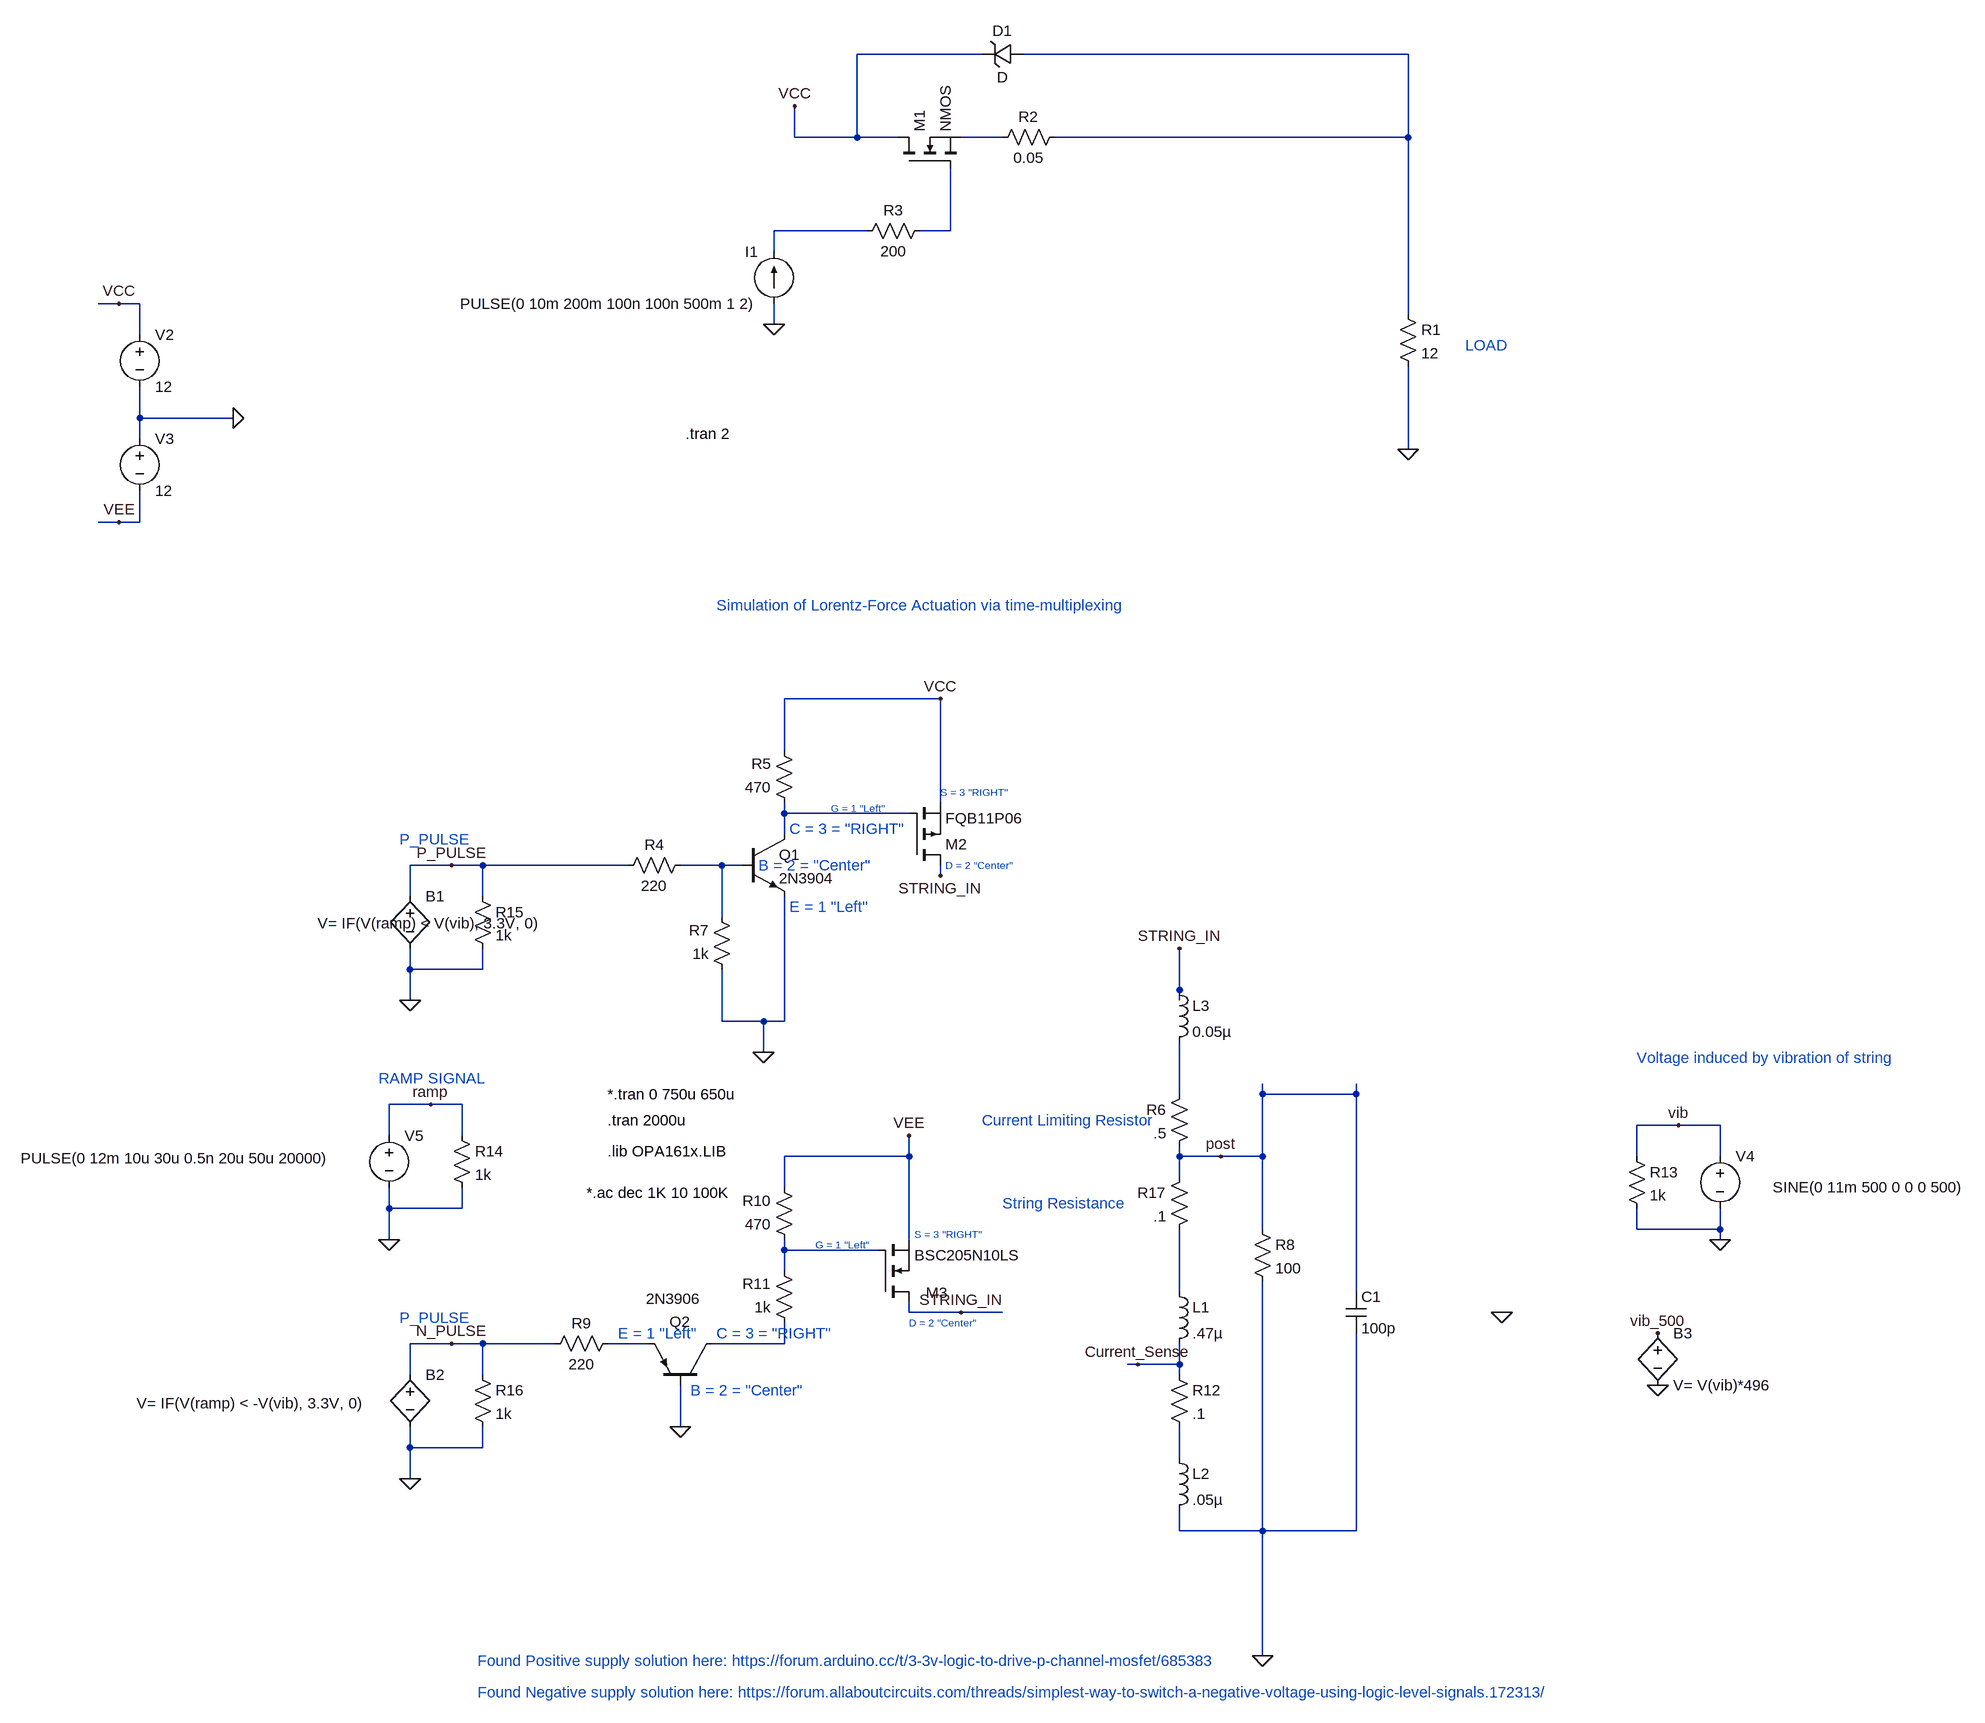
[diagram p0: schematic Draft4.asc]
Draft4.asc, the LTspice schematic file:
Version 4
SHEET 1 1880 2648
WIRE 352 112 160 112
WIRE 1008 112 416 112
WIRE 64 240 64 192
WIRE 160 240 160 112
WIRE 160 240 64 240
WIRE 224 240 160 240
WIRE 384 240 320 240
WIRE 1008 240 1008 112
WIRE 1008 240 464 240
WIRE 176 384 32 384
WIRE 304 384 304 288
WIRE 304 384 256 384
WIRE 32 416 32 384
WIRE -976 496 -1008 496
WIRE -944 496 -976 496
WIRE 1008 512 1008 240
WIRE 32 528 32 496
WIRE -944 544 -944 496
WIRE -944 672 -944 624
WIRE -800 672 -944 672
WIRE -944 704 -944 672
WIRE 1008 720 1008 592
WIRE -976 832 -1008 832
WIRE -944 832 -944 784
WIRE -944 832 -976 832
WIRE 288 1104 48 1104
WIRE 48 1184 48 1104
WIRE 288 1264 288 1104
WIRE 48 1280 48 1264
WIRE 240 1280 48 1280
WIRE 48 1312 48 1280
WIRE -464 1360 -528 1360
WIRE -416 1360 -464 1360
WIRE -192 1360 -416 1360
WIRE -48 1360 -112 1360
WIRE -16 1360 -48 1360
WIRE 288 1376 288 1360
WIRE -528 1408 -528 1360
WIRE -416 1408 -416 1360
WIRE -48 1440 -48 1360
WIRE -528 1520 -528 1488
WIRE -416 1520 -416 1488
WIRE -416 1520 -528 1520
WIRE 656 1552 656 1488
WIRE -528 1568 -528 1520
WIRE 656 1568 656 1552
WIRE -48 1600 -48 1520
WIRE 16 1600 -48 1600
WIRE 48 1600 48 1408
WIRE 48 1600 16 1600
WIRE 16 1648 16 1600
WIRE 656 1712 656 1632
WIRE 784 1712 784 1696
WIRE 928 1712 928 1696
WIRE 928 1712 784 1712
WIRE -496 1728 -560 1728
WIRE -448 1728 -496 1728
WIRE 1424 1760 1360 1760
WIRE 1488 1760 1424 1760
WIRE -560 1776 -560 1728
WIRE -448 1776 -448 1728
WIRE 240 1808 240 1776
WIRE 240 1808 48 1808
WIRE 656 1808 656 1792
WIRE 720 1808 656 1808
WIRE 784 1808 784 1712
WIRE 784 1808 720 1808
WIRE 1360 1808 1360 1760
WIRE 1488 1808 1488 1760
WIRE 656 1840 656 1808
WIRE 48 1856 48 1808
WIRE -560 1888 -560 1856
WIRE -448 1888 -448 1856
WIRE -448 1888 -560 1888
WIRE 784 1920 784 1808
WIRE 1360 1920 1360 1888
WIRE 1488 1920 1488 1888
WIRE 1488 1920 1360 1920
WIRE -560 1936 -560 1888
WIRE 240 1936 240 1808
WIRE 1488 1936 1488 1920
WIRE 48 1952 48 1936
WIRE 192 1952 48 1952
WIRE 48 1984 48 1952
WIRE 656 2016 656 1920
WIRE 928 2016 928 1712
WIRE 240 2048 240 2032
WIRE 320 2048 240 2048
WIRE 384 2048 320 2048
WIRE -464 2096 -528 2096
WIRE -416 2096 -464 2096
WIRE -304 2096 -416 2096
WIRE -160 2096 -224 2096
WIRE 48 2096 48 2064
WIRE 48 2096 -64 2096
WIRE 592 2128 576 2128
WIRE 656 2128 656 2096
WIRE 656 2128 592 2128
WIRE -528 2144 -528 2096
WIRE -416 2144 -416 2096
WIRE 656 2144 656 2128
WIRE -112 2224 -112 2160
WIRE -528 2256 -528 2224
WIRE -416 2256 -416 2224
WIRE -416 2256 -528 2256
WIRE 656 2272 656 2224
WIRE -528 2304 -528 2256
WIRE 656 2384 656 2352
WIRE 784 2384 784 2000
WIRE 784 2384 656 2384
WIRE 928 2384 928 2080
WIRE 928 2384 784 2384
WIRE 784 2576 784 2384
FLAG 64 192 VCC
FLAG 1008 720 0
FLAG 32 528 0
FLAG -976 832 VEE
FLAG -800 672 0
FLAG -976 496 VCC
FLAG 16 1648 0
FLAG 288 1104 VCC
FLAG 784 2576 0
FLAG 656 1488 STRING_IN
FLAG 288 1376 STRING_IN
FLAG 240 1776 VEE
FLAG 320 2048 STRING_IN
FLAG -112 2224 0
FLAG 1152 2048 0
FLAG 592 2128 Current_Sense
FLAG 1488 1936 0
FLAG 1424 1760 vib
FLAG -560 1936 0
FLAG -496 1728 ramp
FLAG -528 1568 0
FLAG -464 1360 P_PULSE
FLAG -528 2304 0
FLAG -464 2096 N_PULSE
FLAG 720 1808 post
FLAG 1392 2160 0
FLAG 1392 2080 vib_500
SYMBOL nmos 224 288 R270
SYMATTR InstName M1
SYMBOL TVSdiode 416 96 R90
WINDOW 0 -4 32 VBottom 2
WINDOW 3 36 32 VTop 2
SYMATTR InstName D1
SYMBOL res 992 496 R0
SYMATTR InstName R1
SYMATTR Value 12
SYMBOL res 480 224 R90
WINDOW 0 0 56 VBottom 2
WINDOW 3 32 56 VTop 2
SYMATTR InstName R2
SYMATTR Value 0.05
SYMBOL current 32 496 R180
WINDOW 0 24 80 Left 2
WINDOW 3 24 0 Left 2
SYMATTR InstName I1
SYMATTR Value PULSE(0 10m 200m 100n 100n 500m 1 2)
SYMBOL res 272 368 R90
WINDOW 0 0 56 VBottom 2
WINDOW 3 32 56 VTop 2
SYMATTR InstName R3
SYMATTR Value 200
SYMBOL voltage -944 528 R0
SYMATTR InstName V2
SYMATTR Value 12
SYMBOL pmos 240 1360 M180
SYMATTR InstName M2
SYMATTR Value FQB11P06
SYMBOL npn -16 1312 R0
SYMATTR InstName Q1
SYMATTR Value 2N3904
SYMBOL res -96 1344 R90
WINDOW 0 0 56 VBottom 2
WINDOW 3 32 56 VTop 2
SYMATTR InstName R4
SYMATTR Value 220
SYMBOL res 64 1280 R180
WINDOW 0 36 76 Left 2
WINDOW 3 36 40 Left 2
SYMATTR InstName R5
SYMATTR Value 470
SYMBOL res 672 1696 M0
SYMATTR InstName R6
SYMATTR Value .5
SYMBOL voltage -944 688 R0
SYMATTR InstName V3
SYMATTR Value 12
SYMBOL ind 640 2000 R0
SYMATTR InstName L1
SYMATTR Value .47µ
SYMBOL res -32 1536 R180
WINDOW 0 36 76 Left 2
WINDOW 3 36 40 Left 2
SYMATTR InstName R7
SYMATTR Value 1k
SYMBOL res 768 1904 R0
SYMATTR InstName R8
SYMATTR Value 100
SYMBOL res -208 2080 R90
WINDOW 0 0 56 VBottom 2
WINDOW 3 32 56 VTop 2
SYMATTR InstName R9
SYMATTR Value 220
SYMBOL res 64 1952 R180
WINDOW 0 36 76 Left 2
WINDOW 3 36 40 Left 2
SYMATTR InstName R10
SYMATTR Value 470
SYMBOL res 64 2080 R180
WINDOW 0 36 76 Left 2
WINDOW 3 36 40 Left 2
SYMATTR InstName R11
SYMATTR Value 1k
SYMBOL nmos 192 2032 M180
WINDOW 0 74 14 Left 2
SYMATTR InstName M3
SYMATTR Value BSC205N10LS
SYMBOL pnp -64 2160 M270
WINDOW 0 98 65 VLeft 2
WINDOW 3 133 101 VLeft 2
SYMATTR InstName Q2
SYMATTR Value 2N3906
SYMBOL res 640 2128 R0
SYMATTR InstName R12
SYMATTR Value .1
SYMBOL cap 912 2016 R0
SYMATTR InstName C1
SYMATTR Value 100p
SYMBOL ind 640 2256 R0
SYMATTR InstName L2
SYMATTR Value .05µ
SYMBOL voltage 1488 1792 R0
WINDOW 3 81 63 Left 2
SYMATTR Value SINE(0 11m 500 0 0 0 500)
SYMATTR InstName V4
SYMATTR Value2 AC 1
SYMBOL res 1344 1792 R0
SYMATTR InstName R13
SYMATTR Value 1k
SYMBOL voltage -560 1760 R0
WINDOW 3 -567 51 Left 2
SYMATTR Value PULSE(0 12m 10u 30u 0.5n 20u 50u 20000)
SYMATTR InstName V5
SYMBOL bv -528 1392 R0
WINDOW 3 -142 57 Left 2
SYMATTR Value V= IF(V(ramp) < V(vib), 3.3V, 0)
SYMATTR InstName B1
SYMBOL res -464 1760 R0
SYMATTR InstName R14
SYMATTR Value 1k
SYMBOL res -432 1392 R0
SYMATTR InstName R15
SYMATTR Value 1k
SYMBOL bv -528 2128 R0
WINDOW 3 -421 60 Left 2
SYMATTR Value V= IF(V(ramp) < -V(vib), 3.3V, 0)
SYMATTR InstName B2
SYMBOL res -432 2128 R0
SYMATTR InstName R16
SYMATTR Value 1k
SYMBOL res 672 1824 M0
SYMATTR InstName R17
SYMATTR Value .1
SYMBOL ind 640 1536 R0
SYMATTR InstName L3
SYMATTR Value 0.05µ
SYMBOL bv 1392 2064 R0
SYMATTR InstName B3
SYMATTR Value V= V(vib)*496
TEXT 1096 560 Left 2 ;LOAD
TEXT -104 696 Left 2 !.tran 2
TEXT -224 1712 Left 2 !*.tran 0 750u 650u
TEXT -208 2080 Left 2 ;E = 1 "Left"
TEXT -96 2168 Left 2 ;B = 2 = "Center"
TEXT -56 2080 Left 2 ;C = 3 = "RIGHT"
TEXT 56 1424 Left 2 ;E = 1 "Left"
TEXT 8 1360 Left 2 ;B = 2 = "Center"
TEXT 56 1304 Left 2 ;C = 3 = "RIGHT"
TEXT 96 1944 Left 1 ;G = 1 "Left"
TEXT 240 2064 Left 1 ;D = 2 "Center"
TEXT 248 1928 Left 1 ;S = 3 "RIGHT"
TEXT 120 1272 Left 1 ;G = 1 "Left"
TEXT 288 1248 Left 1 ;S = 3 "RIGHT"
TEXT 296 1360 Left 1 ;D = 2 "Center"
TEXT -56 960 Left 2 ;Simulation of Lorentz-Force Actuation via time-multiplexing
TEXT -424 2632 Left 2 ;Found Negative supply solution here: https://forum.allaboutcircuits.com/threads/simplest-way-to-switch-a-negative-voltage-using-logic-level-signals.172313/
TEXT -424 2584 Left 2 ;Found Positive supply solution here: https://forum.arduino.cc/t/3-3v-logic-to-drive-p-channel-mosfet/685383
TEXT -576 1688 Left 2 ;RAMP SIGNAL
TEXT -544 1320 Left 2 ;P_PULSE
TEXT -544 2056 Left 2 ;P_PULSE
TEXT 1360 1656 Left 2 ;Voltage induced by vibration of string
TEXT -224 1752 Left 2 !.tran 2000u
TEXT -224 1800 Left 2 !.lib OPA161x.LIB
TEXT 352 1752 Left 2 ;Current Limiting Resistor
TEXT 384 1880 Left 2 ;String Resistance
TEXT -256 1864 Left 2 !*.ac dec 1K 10 100K

The netlist it stands for:
* Draft4.asc
M1 VCC N004 N002 N002 NMOS
D1 N001 VCC D
R1 N001 0 12
R2 N001 N002 0.05
I1 0 N003 PULSE(0 10m 200m 100n 100n 500m 1 2)
R3 N004 N003 200
V2 VCC 0 12
M2 STRING_IN N005 VCC VCC FQB11P06
Q1 N005 N006 0 0 2N3904
R4 N006 P_PULSE 220
R5 N005 VCC 470
R6 N007 post .5
V3 0 VEE 12
L1 N009 Current_Sense .47µ
R7 0 N006 1k
R8 post 0 100
R9 N010 N_PULSE 220
R10 N008 VEE 470
R11 N011 N008 1k
M3 STRING_IN N008 VEE VEE BSC205N10LS
Q2 N011 0 N010 0 2N3906
R12 Current_Sense N012 .1
C1 post 0 100p
L2 N012 0 .05µ
V4 vib 0 SINE(0 11m 500 0 0 0 500) AC 1
R13 vib 0 1k
V5 ramp 0 PULSE(0 12m 10u 30u 0.5n 20u 50u 20000)
B1 P_PULSE 0 V= IF(V(ramp) < V(vib), 3.3V, 0)
R14 ramp 0 1k
R15 P_PULSE 0 1k
B2 N_PULSE 0 V= IF(V(ramp) < -V(vib), 3.3V, 0)
R16 N_PULSE 0 1k
R17 post N009 .1
L3 STRING_IN N007 0.05µ
B3 vib_500 0 V= V(vib)*496
.model D D
.lib standard.dio
.model NPN NPN
.model PNP PNP
.lib standard.bjt
.model NMOS NMOS
.model PMOS PMOS
.lib standard.mos
* LOAD
.tran 2
*.tran 0 750u 650u
* E = 1 "Left"
* B = 2 = "Center"
* C = 3 = "RIGHT"
* E = 1 "Left"
* B = 2 = "Center"
* C = 3 = "RIGHT"
* G = 1 "Left"
* D = 2 "Center"
* S = 3 "RIGHT"
* G = 1 "Left"
* S = 3 "RIGHT"
* D = 2 "Center"
* Simulation of Lorentz-Force Actuation via time-multiplexing
* Found Negative supply solution here: https://forum.allaboutcircuits.com/threads/simplest-way-to-switch-a-negative-voltage-using-logic-level-signals.172313/
* Found Positive supply solution here: https://forum.arduino.cc/t/3-3v-logic-to-drive-p-channel-mosfet/685383
* RAMP SIGNAL
* P_PULSE
* P_PULSE
* Voltage induced by vibration of string
.tran 2000u
.lib OPA161x.LIB
* Current Limiting Resistor
* String Resistance
*.ac dec 1K 10 100K
.backanno
.end